# EasyEDA Pro project ProPrj_ProjetElectronique_ESP32Board_2024-12-16.epro, board ESP32Board PCB
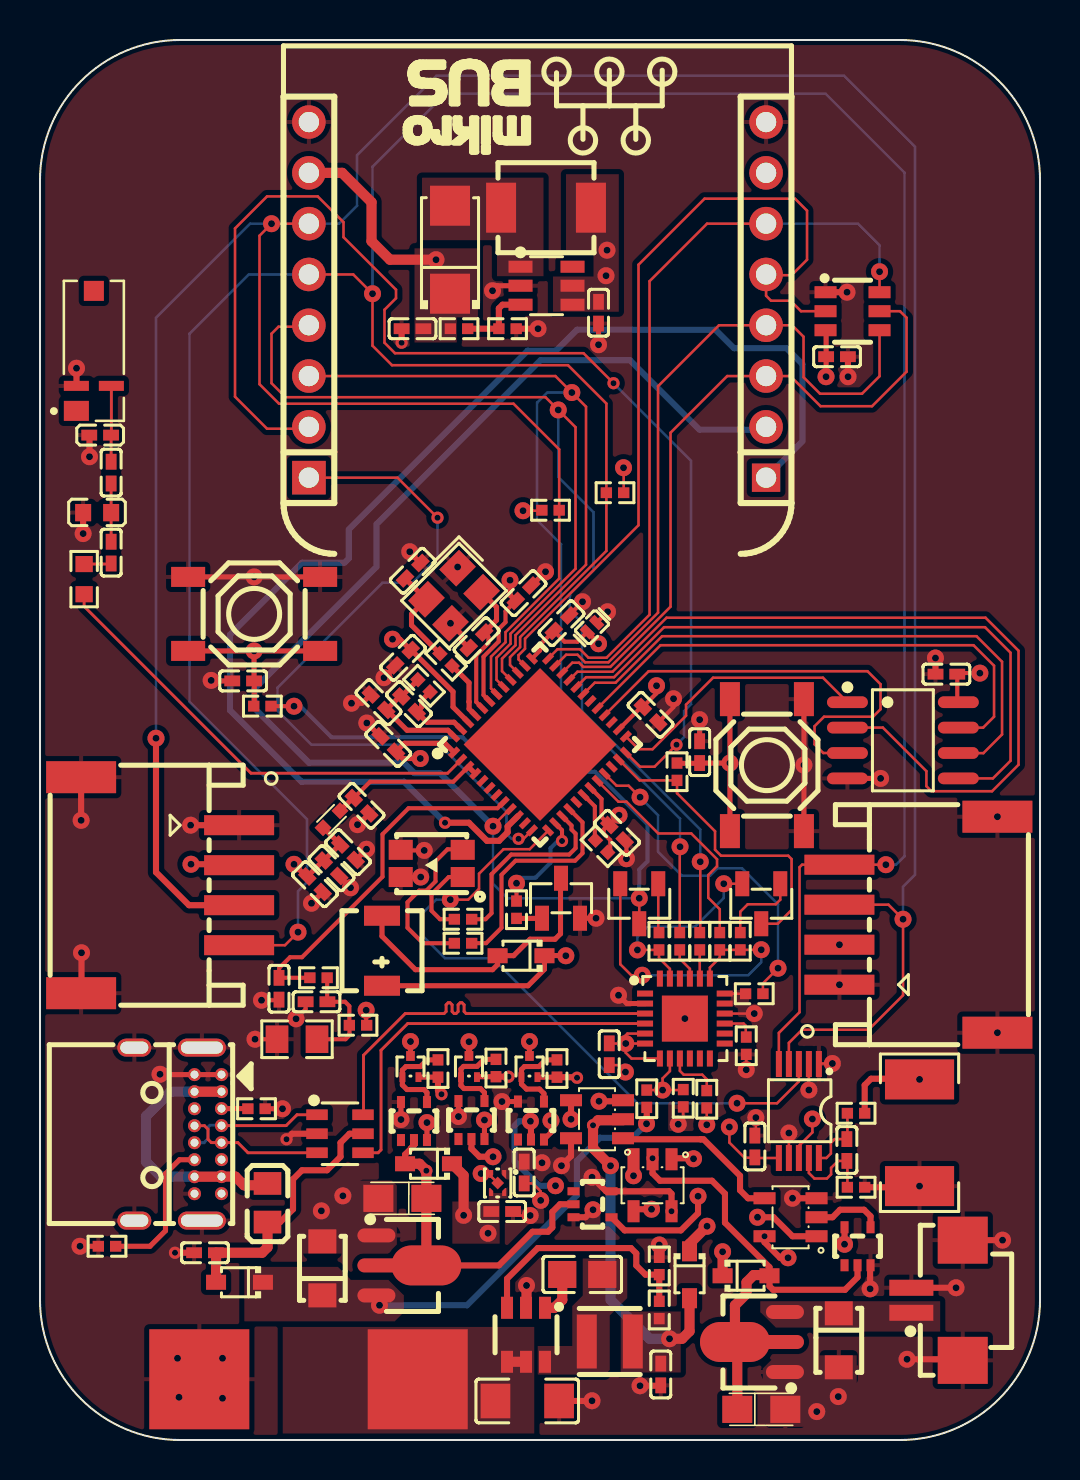
[diagram p7: board, top side]
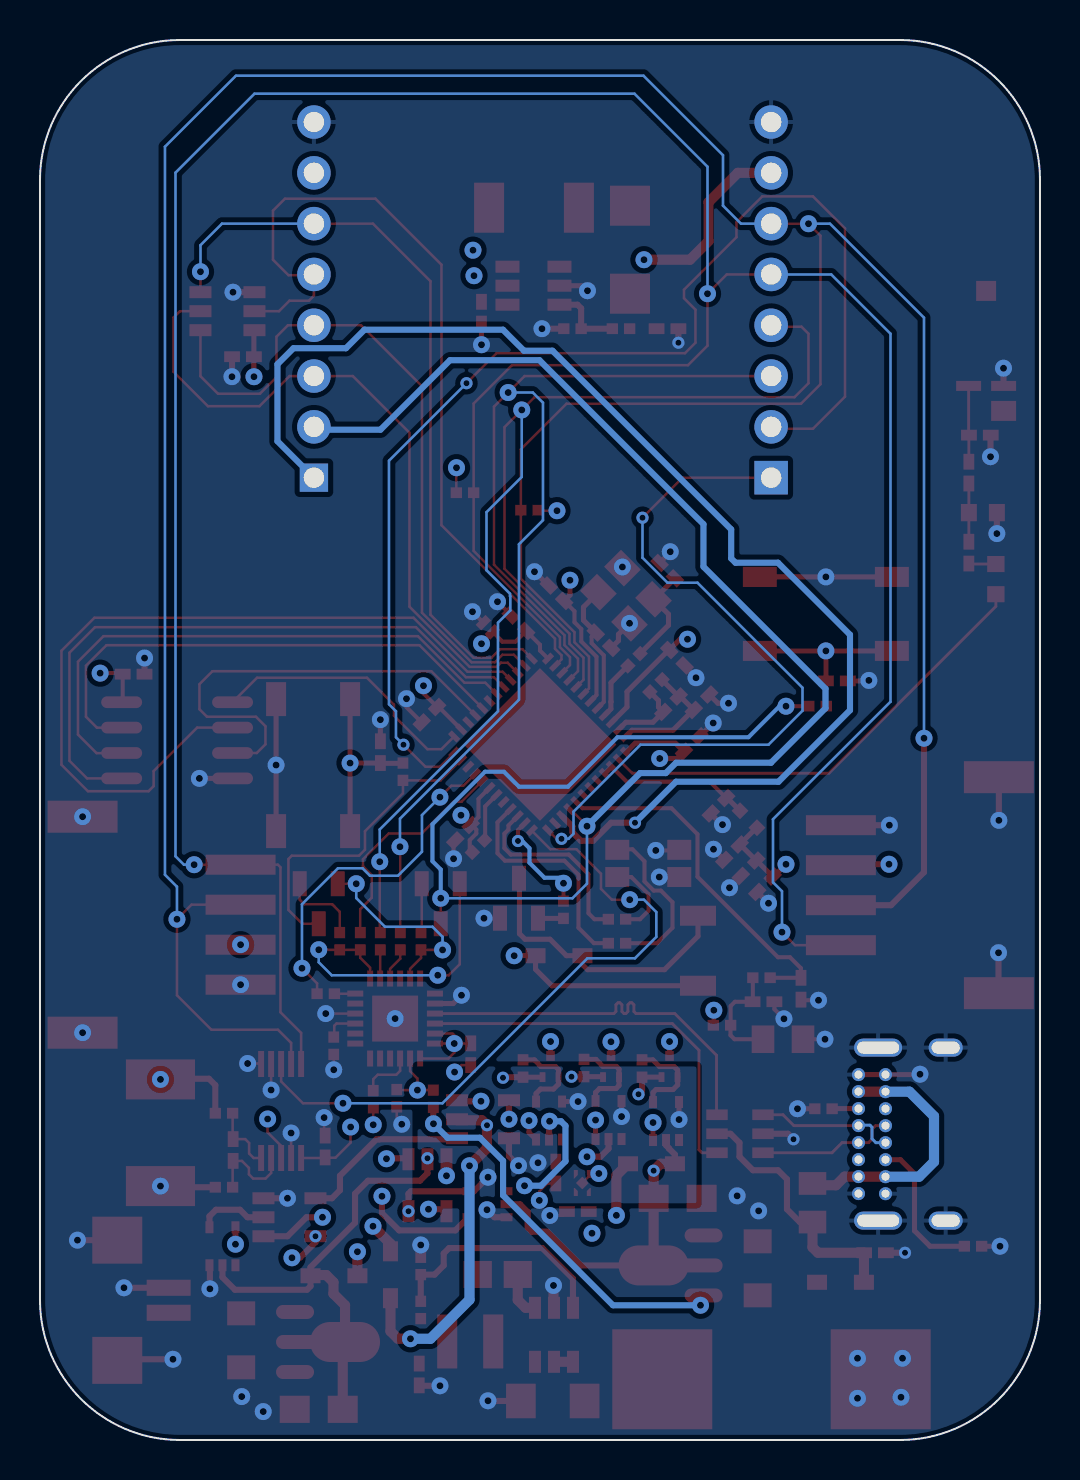
[diagram p8: board, bottom side, seen from below]

Outline 50 x 70 mm; copper layers: Top Layer, GND, PWR, Bottom Layer. Coordinates in mm from the lower left corner of the outline.
Outline path: 0,63 0,7 arc(2.05,2.05) 7,0 43,0 arc(47.95,2.05) 50,7 50,63 arc(47.95,67.95) 43,70 7,70 arc(2.05,67.95) 0,63
Stack: Top Layer 0.035mm Outer layer copper thickness 1oz / Dielectric1 0.2104mm 7628 RC49% 8.6mil / GND 0.0152mm Inner layer copper thickness / Dielectric2 1.065mm 1.1mm H/HOZ Copper / PWR 0.0152mm Inner layer copper thickness / Dielectric3 0.2104mm 7628 RC49% 8.6mil / Bottom Layer 0.035mm Outer layer copper thickness 1oz

## Design rules (mm)
net USB-: DP2
net USB+: DP2
net USB_ESD+: DP1
net USB_ESD-: DP1
template: JLCPCB Capability(Two Layers Board)
spacing copperThickness1oz (default): track to track 0.102, other pairs 0.152 to 0.3
spacing copperThickness2oz: track to track 0.203, other pairs 0.152 to 0.3
track width copperThickness1oz (default): min 0.127, default 0.254, max 2.54
track width copperThickness2oz: min 0.203, default 0.254, max 2.54
differential pair differentialPair (default): width min 0.127, default 0.254, max 2.54; gap min 0.152, default 0.152
via viaSize (default): diameter min 0.5, default 0.61, max 10; hole min 0.3, default 0.305, max 6.3

## Placement (name value [footprint] x y rotation side)
BUZZER1  4kHz  [BUZ-SMD_L4.0-W4.0-P3.50-L]  17.1 24.46 90 top
C1  1uF  [C0402]  15.4 29.39 135 top
C6  100nF  [C0402]  28.85 30.36 135 top
C11  10nF  [C0402]  16.92 36.89 135 top
C12  3.3nF  [C0402]  18.45 36.79 315 top
C13  18pF  [C0402]  18.64 43.46 45 top
C14  100nF  [C0402]  26.08 40.84 45 top
C17  100nF  [C0402]  16.08 31.71 135 top
C18  1uF  [C0402]  14.58 28.59 135 top
C19  100nF  [C0402]  13.75 27.79 135 top
C20  100nF  [C0402]  17.41 34.8 315 top
C21  18pF  [C0402]  21.83 39.99 225 top
C22  1uF  [C0402]  18.15 39.11 45 top
C23  100pF  [C0402]  24.18 42.34 225 top
C24  100nF  [C0402]  30.53 36.26 135 top
C25  0.4pF  [C0402]  3.56 44.37 270 top
C26  0.4pF  [C0402]  3.56 48.37 270 top
C27  100nF  [C0402]  8.25 9.36 0 top
C28  100nF  [C0402]  39.85 54.16 180 top
C29  100nF  [C0402]  28.46 19.29 90 top
C30  100nF  [C0402]  10.16 37.95 180 top
C31  100nF  [C0402]  32.98 34.39 90 top
C32  100nF  [C0402]  35.74 14.68 270 top
C33  1uF  [C0402]  40.34 14.5 90 top
C165  22uF  [C0402]  27.93 56.36 90 top
C166  22uF  [C0402]  18.63 55.56 0 top
C168  22uF  [CASE-A_3216]  36.06 1.53 0 top
C170  22uF  [CASE-A_3216]  18.12 12.08 180 top
C171  10uF  [CAP-SMD_L3.2-W1.6]  14.12 8.58 90 top
C172  10uF  [CAP-SMD_L3.2-W1.6]  39.94 4.98 270 top
C173  2.2uF  [C1206]  24.36 1.95 180 top
C174  100nF  [C0805]  27.11 8.28 180 top
C175  10uF  [C0402]  31.04 3.28 90 top
C176  1uF  [C0402]  23.11 11.43 180 top
C177  1uF  [C0402]  24.21 13.38 90 top
C178  100nF  [C0402]  45.32 38.29 0 top
C181  47nF  [C0402]  11.95 22.56 90 top
C182  47nF  [C0402]  13.83 21.91 0 top
CN1  114020164  [CONN-SMD_4P-P2.00_HX20020-4AWB]  43.92 25.77 90 top
CN2  114020164  [CONN-SMD_4P-P2.00_HX20020-4AWB]  6.01 27.74 270 top
CN3  HC-1.25-2PWT  [CONN-SMD_2P-P1.25-HC-1.25-2PWT]  44.85 6.99 90 top
D2  RCLAMP0521P-N  [X1-DFN1006-2_L1.0-W0.6-P0.65-BI]  27.6 40.64 45 top
D4  SD103AWS-7-F  [SOD-323_L1.8-W1.3-LS2.5-RD]  24.05 24.21 180 top
D5  SD103AWS-7-F  [SOD-323_L1.8-W1.3-LS2.5-RD]  9.98 7.89 180 top
D6  SD103AWS-7-F  [SOD-323_L1.8-W1.3-LS2.5-RD]  19.42 13.81 180 top
D19  SS34  [SMA_L4.3-W2.6-LS5.2-RD]  20.5 59.51 90 top
D20  SD103AWS-7-F  [SOD-323_L1.8-W1.3-LS2.5-RD]  35.3 8.21 0 top
D21  SD103AWS-7-F  [SOD-323_L1.8-W1.3-LS2.5-RD]  32.48 8.26 270 top
L1  GZ2012D101TF  [L0805]  11.38 11.86 90 top
L2  2nH  [IND-SMD_L1.2-W0.6]  14.58 31.04 45 top
L4  4.8nH  [L0402]  3.01 50.24 0 top
L7  4.7uH  [IND-SMD_L4.8-W4.5]  25.3 61.61 180 top
L9  3.3uH  [IND-SMD_L3.0-W3.0-1]  28.49 4.93 0 top
LED1  LTST-C155GEKT  [LED-SMD_4P-L3.2-W2.7-TL_LTST-C155GEKT]  19.59 28.83 180 top
Q14  PCJ3139K  [SOT-723_L1.2-W0.8-P0.40-LS1.2-BR]  18.52 18.67 270 top
Q15  SS8050-G  [SOT-23-3_L2.9-W1.3-P1.90-LS2.4-BR]  26.05 27.09 270 top
Q16  SS8050-G  [SOT-23-3_L2.9-W1.3-P1.90-LS2.4-BR]  29.96 26.81 90 top
Q17  SS8050-G  [SOT-23-3_L2.9-W1.3-P1.90-LS2.4-BR]  36.06 26.81 90 top
Q18  PCJ3139K  [SOT-723_L1.2-W0.8-P0.40-LS1.2-BR]  24.47 18.67 270 top
Q19  PCJ3139K  [SOT-723_L1.2-W0.8-P0.40-LS1.2-BR]  21.45 18.67 270 top
R2  0Ω  [R0402]  28.08 29.69 315 top
R101  0Ω  [R0603]  2.21 43.04 270 top
R102  5.1kΩ  [R0402]  3.35 9.69 180 top
R103  5.1kΩ  [R0402]  10.83 16.56 0 top
R104  180Ω  [R0402]  23.83 26.51 270 top
R105  10kΩ  [R0402]  30.95 24.94 90 top
R106  10kΩ  [R0402]  35.01 24.94 90 top
R107  22.1kΩ  [R0402]  30.34 17.06 270 top
R108  47.5kΩ  [R0402]  32.16 17.09 90 top
R109  2kΩ  [R0402]  33.34 17.04 270 top
R110  10kΩ  [R0402]  35.31 19.71 270 top
R111  1kΩ  [R0402]  31.99 24.94 270 top
R112  1kΩ  [R0402]  32.99 24.94 270 top
R113  0Ω  [R0402]  33.99 24.94 90 top
R114  0Ω  [R0402]  35.71 22.31 0 top
R115  0Ω  [R0402]  11.12 36.69 180 top
R116  0Ω  [R0402]  31.85 33.41 90 top
R119  100Ω  [R0402]  21.15 26.04 0 top
R120  100Ω  [R0402]  21.15 24.84 0 top
R121  10kΩ  [R0402]  25.53 46.49 180 top
R122  10kΩ  [R0402]  28.75 47.36 0 top
R123  SDNT2012X103F3950FTF  [R0805]  12.85 20.04 0 top
R124  10kΩ  [R0402]  15.9 20.74 0 top
R125  90.9Ω  [R0402]  40.8 16.34 0 top
R126  90.9Ω  [R0402]  40.8 12.64 0 top
R127  100kΩ  [R0402]  19.9 18.57 270 top
R128  100kΩ  [R0402]  25.85 18.57 270 top
R129  100kΩ  [R0402]  22.8 18.6 270 top
R134  110kΩ  [R0402]  20.95 55.56 180 top
R135  15kΩ  [R0402]  23.38 55.56 180 top
R136  51kΩ  [R0402]  30.96 6.5 270 top
R137  22.1kΩ  [R0402]  30.96 8.7 270 top
R138  5.1kΩ  [R0402]  13.92 23.11 0 top
SW1  TS-1187A-B-A-B  [SW-SMD_4P-L5.1-W5.1-P3.70-LS6.5-TL-2]  10.71 41.3 180 top
SW4  TS-1187A-B-A-B  [SW-SMD_4P-L5.1-W5.1-P3.70-LS6.5-TL-2]  36.35 33.74 90 top
U1  -  [LGA-48_L7.0-W7.0-P0.50-BL-EP5.4]  25 34.78 315 top
U2  CP2104-F03-GM  [VQFN-24_L4.0-W4.0-P0.50-BL-EP2.3]  32.24 21.07 270 top
U4  51Ω  [R0402]  20.3 39.01 135 top
U6  20kΩ  [R0402]  19.2 37.71 315 top
U9  USBLC6-4SC6  [SOT-23-6_L2.9-W1.6-P0.95-LS2.8-BL]  15 15.31 270 top
U71  INA237AIDGSR  [VSSOP-10_L3.0-W3.0-P0.50-LS4.9-BL]  37.94 16.45 180 top
U72  LMR50410Y3FQDBVRQ1  [SOT-23-6_L2.9-W1.6-P0.95-LS2.8-BR]  24.3 5.26 90 top
U76  AMS1117-3.3  [SOT-89-3_L4.5-W2.5-P1.50-LS4.1-BL]  36 4.9 90 top
U77  -  [XCVR_NN03-320]  2.69 54.46 270 top
U78  VTI7064MSME  [SOIC-8_L4.9-W3.9-P1.27-LS6.0-BL]  43.14 34.98 270 top
U80  TMP125AIDBVR  [SOT-23-6_L2.9-W1.6-P0.95-LS2.8-BR]  40.63 56.44 180 top
U81  7.5nH  [L0603]  2.86 46.37 0 top
U82  MIKROBUS_HOST_CONN  [MIKROBUSTOP]  24.87 57.01 180 top
U84  -  [High Voltage Pads]  13.42 3.04 180 top
U86  74LVC1G14GW,125  [SOT-353-5_L2.0-W2.1-P0.65-BR]  27.63 11.79 180 top
U90  74LVC1G14GW,125  [SOT-353-5_L2.0-W2.1-P0.65-BR]  40.88 9.69 270 top
U91  SN74AHC1G08DBVR  [SOT-23-5_L3.0-W1.7-P0.95-LS2.8-BR]  30.63 12.74 90 top
U92  SN74AHC1G08DBVR  [SOT-23-5_L3.0-W1.7-P0.95-LS2.8-BR]  37.53 11.14 0 top
U93  SN74AHC1G08DBVR  [SOT-23-5_L3.0-W1.7-P0.95-LS2.8-BR]  27.85 16.04 0 top
U94  74LVC1G14GW,125  [SOT-353-5_L2.0-W2.1-P0.65-BR]  18.7 15.95 270 top
U95  74LVC1G14GW,125  [SOT-353-5_L2.0-W2.1-P0.65-BR]  21.57 16 270 top
U96  74LVC1G14GW,125  [SOT-353-5_L2.0-W2.1-P0.65-BR]  24.55 15.97 270 top
U128  MT3608L  [SOT-23-6_L2.9-W1.6-P0.95-LS2.8-BL_3]  25.33 57.71 270 top
U129  AMS1117-3.3  [SOT-89-3_L4.5-W2.5-P1.50-LS4.1-BL]  18.07 8.73 270 top
U130  NCP167BMX330TBG  [XDFN-4_L1.0-W1.0-P0.65-BL-EP]  22.88 12.85 180 top
U131  0.5mΩ  [RES-SMD_L6.3-W3.2_R2512]  43.98 15.36 90 top
USB2  USB4085-GF-A  [USC-C-SMD_USB4085-GF-A]  6.89 15.29 270 top
X2  40MHz  [CRYSTAL-SMD_4P-L3.2-W2.5-BL]  20.7 42.21 225 top

## Footprints (pads in the part's own frame, mm; a bottom-side part is the same pattern mirrored in y, then rotated)
BUZ-SMD_L4.0-W4.0-P3.50-L
  rect 1x1.8 smd: 1(-1.75,0) 2(1.75,0)
C0402
  rect 0.79x0.54 smd: 1(-0.545,0) 2(0.545,0)
C0805
  rect 1.41x1.35 smd: 1(-1,0) 2(1,0)
C1206
  rect 1.485x1.728 smd: 1(-1.593,0) 2(1.593,0)
CAP-SMD_L3.2-W1.6
  rect 1.2x1.4 smd: 1(-1.35,0) 2(1.35,0)
CASE-A_3216
  rect 1.5x1.359 smd: 1(-1.2,0) 2(1.2,0)
CONN-SMD_2P-P1.25-HC-1.25-2PWT
  rect 0.8x2.2 smd: 1(-0.625,1.285) 2(0.625,1.285)
  rect 2.35x2.5 smd: 3(-3.005,-1.285) 4(3.005,-1.285)
CONN-SMD_4P-P2.00_HX20020-4AWB
  rect 1x3.5 smd: 1(-3,3.95) 2(-1,3.95) 3(1,3.95) 4(3,3.95)
  rect 1.6x3.5 smd: 5(5.4,-3.95) 6(-5.4,-3.95)
CRYSTAL-SMD_4P-L3.2-W2.5-BL
  rect 1.4x1.2 smd: 1(-1.1,-0.85) 2(1.1,-0.85) 3(1.1,0.85) 4(-1.1,0.85)
High Voltage Pads
  rect 5x5 smd: 1(-5.461,0) 2(5.461,0)
IND-SMD_L1.2-W0.6
  rect 0.6x0.6 smd: 1(-0.6,0) 2(0.6,0)
IND-SMD_L3.0-W3.0-1
  rect 1x2.7 smd: 1(-1.15,0) 2(1.15,0)
IND-SMD_L4.8-W4.5
  rect 1.5x2.5 smd: 1(-2.245,0) 2(2.245,0)
L0402
  rect 0.79x0.54 smd: 1(-0.545,0) 2(0.545,0)
L0603
  rect 0.8x0.864 smd: 1(-0.7,0) 2(0.7,0)
L0805
  rect 1.133x1.377 smd: 1(-0.966,0) 2(0.966,0)
LED-SMD_4P-L3.2-W2.7-TL_LTST-C155GEKT
  rect 1.2x1 smd: 1(-1.55,0.68) 2(-1.55,-0.68) 3(1.55,0.68) 4(1.55,-0.68)
LGA-48_L7.0-W7.0-P0.50-BL-EP5.4
  rect 0.27x0.6 smd: 1(-2.75,-3.32) 2(-2.25,-3.32) 3(-1.75,-3.32) 4(-1.25,-3.32) 5(-0.75,-3.32) 6(-0.25,-3.32) 7(0.25,-3.32) 8(0.75,-3.32) 9(1.25,-3.32) 10(1.75,-3.32) 11(2.25,-3.32) 12(2.75,-3.32) 25(2.75,3.32) 26(2.25,3.32) 27(1.75,3.32) 28(1.25,3.32) 29(0.75,3.32) 30(0.25,3.32) 31(-0.25,3.32) 32(-0.75,3.32) 33(-1.25,3.32) 34(-1.75,3.32) 35(-2.25,3.32) 36(-2.75,3.32)
  rect 0.6x0.27 smd: 13(3.32,-2.75) 14(3.32,-2.25) 15(3.32,-1.75) 16(3.32,-1.25) 17(3.32,-0.75) 18(3.32,-0.25) 19(3.32,0.25) 20(3.32,0.75) 21(3.32,1.25) 22(3.32,1.75) 23(3.32,2.25) 24(3.32,2.75) 37(-3.32,2.75) 38(-3.32,2.25) 39(-3.32,1.75) 40(-3.32,1.25) 41(-3.32,0.75) 42(-3.32,0.25) 43(-3.32,-0.25) 44(-3.32,-0.75) 45(-3.32,-1.25) 46(-3.32,-1.75) 47(-3.32,-2.25) 48(-3.32,-2.75)
  rect 5.4x5.4 smd: 49(0,0)
MIKROBUSTOP
  rect 1.415x1.415 hole 1.016: 1(-11.429,8.89)
  round 1.677 hole 1.016: 2(-11.43,6.349) 3(-11.43,3.809) 4(-11.43,1.27) 5(-11.43,-1.27) 6(-11.43,-3.811) 7(-11.43,-6.351) 8(-11.43,-8.89) 9(11.43,-8.89) 10(11.43,-6.351) 11(11.43,-3.811) 12(11.43,-1.27) 13(11.43,1.27) 14(11.43,3.809) 15(11.43,6.349)
  rect 1.677x1.677 hole 1.016: 16(11.43,8.889)
R0402
  rect 0.566x0.54 smd: 1(-0.433,0) 2(0.433,0)
R0603
  rect 0.806x0.864 smd: 1(-0.753,0) 2(0.753,0)
R0805
  rect 1.133x1.377 smd: 1(-1,0) 2(1,0)
RES-SMD_L6.3-W3.2_R2512
  rect 2x3.456 smd: 1(-2.667,0) 2(2.667,0)
SMA_L4.3-W2.6-LS5.2-RD
  rect 2x2 smd: 1(-2.2,0) 2(2.2,0)
SOD-323_L1.8-W1.3-LS2.5-RD
  rect 1x0.75 smd: 1(-1.173,0) 2(1.173,0)
SOIC-8_L4.9-W3.9-P1.27-LS6.0-BL
  oval 0.588x2.045 smd: 1(-1.905,-2.772) 2(-0.635,-2.772) 3(0.635,-2.772) 4(1.905,-2.772) 5(1.905,2.772) 6(0.635,2.772) 7(-0.635,2.772) 8(-1.905,2.772)
SOT-23-3_L2.9-W1.3-P1.90-LS2.4-BR
  rect 1.25x0.7 smd: 1(1,-0.95) 2(1,0.95) 3(-1,0)
SOT-23-5_L3.0-W1.7-P0.95-LS2.8-BR
  rect 1.1x0.6 smd: 1(1.3,-0.95) 2(1.3,0) 3(1.3,0.95) 4(-1.3,0.95) 5(-1.3,-0.95)
SOT-23-6_L2.9-W1.6-P0.95-LS2.8-BL
  rect 0.532x1.072 smd: 1(-0.95,-1.149) 2(0,-1.149) 3(0.95,-1.149) 4(0.95,1.149) 5(0,1.149) 6(-0.95,1.149)
SOT-23-6_L2.9-W1.6-P0.95-LS2.8-BL_3
  rect 0.6x1.2 smd: 1(-0.95,-1.3) 2(0,-1.3) 3(0.95,-1.3) 4(0.95,1.3) 5(0,1.3) 6(-0.95,1.3)
SOT-23-6_L2.9-W1.6-P0.95-LS2.8-BR
  rect 1.1x0.6 smd: 1(1.35,-0.95) 2(1.35,0) 3(1.35,0.95) 4(-1.35,0.95) 5(-1.35,0) 6(-1.35,-0.95)
SOT-89-3_L4.5-W2.5-P1.50-LS4.1-BL
  oval 0.7x1.9 smd: 1(-1.501,-1.25) 3(1.501,-1.25)
  oval 2x3.5 smd: 2(0,1.25)
  oval 0.7x2.1 smd: 2(0,-1.151)
SOT-353-5_L2.0-W2.1-P0.65-BR
  rect 0.6x0.4 smd: 1(0.95,-0.65) 2(0.95,0) 3(0.95,0.65) 4(-0.95,0.65) 5(-0.95,-0.65)
SOT-723_L1.2-W0.8-P0.40-LS1.2-BR
  rect 0.489x0.294 smd: 1(0.529,-0.4) 2(0.529,0.4)
  rect 0.489x0.434 smd: 3(-0.529,0)
SW-SMD_4P-L5.1-W5.1-P3.70-LS6.5-TL-2
  rect 1.7x1 smd: 1(-3.3,1.85) 2(3.3,1.85) 3(-3.3,-1.85) 4(3.3,-1.85)
USC-C-SMD_USB4085-GF-A
  round 0.65 hole 0.4: A1(-2.975,2.18) A4(-2.125,2.18) A5(-1.275,2.18) A6(-0.425,2.18) A7(0.425,2.18) A8(1.275,2.18) A9(2.125,2.18) A12(2.975,2.18) B1(2.98,0.83) B4(2.13,0.83) B5(1.28,0.83) B6(0.43,0.83) B7(-0.42,0.83) B8(-1.27,0.83) B9(-2.12,0.83) B12(-2.975,0.83)
  oval 0.9x2.4 hole 0.6x2.1: S1(-4.325,1.2) S1(4.325,1.2)
  oval 0.9x1.7 hole 0.6x1.4: S1(-4.325,-2.18) S1(4.325,-2.18)
VQFN-24_L4.0-W4.0-P0.50-BL-EP2.3
  rect 0.3x0.8 smd: 1(-1.25,-1.992) 2(-0.75,-1.992) 3(-0.25,-1.992) 4(0.25,-1.992) 5(0.75,-1.992) 6(1.25,-1.992) 13(1.25,1.992) 14(0.75,1.992) 15(0.25,1.992) 16(-0.25,1.992) 17(-0.75,1.992) 18(-1.25,1.992)
  rect 0.8x0.3 smd: 7(1.998,-1.25) 8(1.998,-0.75) 9(1.998,-0.25) 10(1.998,0.25) 11(1.998,0.75) 12(1.998,1.25) 19(-1.998,1.25) 20(-1.998,0.75) 21(-1.998,0.25) 22(-1.998,-0.25) 23(-1.998,-0.75) 24(-1.998,-1.25)
  rect 2.3x2.3 smd: 25(0.001,-0.001)
VSSOP-10_L3.0-W3.0-P0.50-LS4.9-BL
  rect 0.3x1.3 smd: 1(-1,-2.35) 2(-0.5,-2.35) 3(0,-2.35) 4(0.5,-2.35) 5(1,-2.35) 6(1,2.35) 7(0.5,2.35) 8(0,2.35) 9(-0.5,2.35) 10(-1,2.35)
X1-DFN1006-2_L1.0-W0.6-P0.65-BI
  rect 0.4x0.7 smd: 1(-0.325,0) 2(0.325,0)
XCVR_NN03-320
  rect 1x1 smd: 1(-3,0)
  rect 0.5x1.25 smd: 2(1.75,-0.875) 3(1.75,0.875)
  rect 1x1.25 smd: 4(3,-0.875)
XDFN-4_L1.0-W1.0-P0.65-BL-EP
  custom 0.2x0.45 smd: 1(-0.325,-0.475)
  custom 0.2x0.4 smd: 2(0.325,-0.475) 3(0.325,0.475) 4(-0.325,0.475)
  rect 0.45x0.45 smd rot 45: 5(0,0)

## Nets
As in the schematic, except:
GND: C1.1 C6.1 C11.2 C13.2 C14.2 C17.1 C18.1 C19.1 C20.1 C21.2 C22.1 C23.1 C24.1 C27.1 C28.1 C29.1 C30.2 C31.2 C32.1 C165.1 C166.1 C168.2 C170.2 C171.2 C172.2 C173.1 C175.1 C176.1 C177.1 C178.1 C181.1 C182.1 CN1.1 CN1.5 CN1.6 CN2.1 CN2.5 CN2.6 CN3.2 CN3.3 CN3.4 D2.2 L4.1 LED1.3 LED1.4 Q15.2 R102.2 R103.2 R108.1 R110.2 R123.1 R126.2 R135.1 R137.1 SW1.3 SW1.4 SW4.3 SW4.4 U1.49 U2.2 U2.16 U2.25 U9.2 U71.1 U71.2 U71.7 U72.2 U76.1 U77.2 U78.4 U80.1 U81.1 U82.8 U82.9 U84.2 U86.3 U90.3 U91.3 U92.3 U93.3 U94.3 U95.3 U96.3 U128.2 U129.1 U130.2 U130.5 U131.1 USB2.A1 USB2.A12 USB2.B1 USB2.B12 USB2.S1 X2.1 X2.3

Pads without a net: U1 5 6 7 11 17 22 27 30; U2 1 10 11 12 13 14 17 22 24; U77 1 4; U86 1; U90 1; U94 1; U95 1; U96 1; U128 6; USB2 A8 B8

## Via types
v1: diameter 0.85, hole 0.35, Top Layer to Bottom Layer, 157 vias
v2: diameter 0.61, hole 0.305, Top Layer to Bottom Layer, 17 vias

## Routing (per net, layer and track width the routed paths; a pad name or vN(x,y) marks a point on that pad's centre or on a via; arc(x,y) is an arc through that point)
+3V3: length 73.6
  Top Layer w0.127: R109.2 v1(33.34,15.76) ; 30.99,19.07 29.58,19.07 29.29,19.36 v1(29.29,19.82) ; v1(34.47,15.65) 34.47,14.87 35.23,14.11 35.73,14.11 C32.2 35.77,14.1 U71.6 ; U2.6 29.29,19.82 v1(29.29,19.82) ; R122.2 29.18,48.61 v1(29.18,48.61) ; v1(29.29,19.82) 29.29,20.24 29.37,20.32 30.25,20.32 ; v1(29.29,19.82) 28.47,19.82 C29.2 ; v1(24.15,46.46) 25.07,46.46 R121.2 ; U71.8 37.94,14.7 38.62,15.38 v1(38.62,16.05)
  Top Layer w0.203: U1.37 25,39.47 25,39.76 25.69,40.45 26.23,39.91 26.88,39.91 D2.1 27.93,39.85 v1(27.93,39.81) ; v1(28.95,31.24) 28.47,30.75 C6.2 ; U1.19 28.08,32.05 28.08,31.14 C6.2 ; R124.2 16.31,20.76 v1(16.31,21.49) ; C6.2 28.41,30.75 28.18,30.52 28.18,30.32 28.51,29.99 28.51,29.51 28.38,29.38 ; U1.43 22.18,37.25 22.18,39.17 22.93,39.93 22.93,40.55 23.28,40.89 23.28,41.44 23.79,41.95 ; v1(46.99,38.34) 46.99,38.35 45.92,38.35 C178.2 45.86,36.94 U78.8 ; v1(30.83,37.71) 30.83,37.33 C24.2 30.06,36.65 U1.26
  Top Layer w0.254: U1.1 20.24,34.84 18.22,34.84 C20.2 18.14,34.08 v1(19.01,34.08) ; U80.3 39.31,55.46 C28.2 39.31,53.17 v1(39.3,53.16) ; v1(17.63,40.04) 18,40.04 18.54,39.5 18.57,39.5 20.65,37.41 20.65,36.65 U1.46 ; BUZZER1.1 24.4,22.71 25.22,23.54 D4.1 25.23,24.22 26.28,24.22 v1(26.29,24.21) ; v1(12.7,28.78) 13.31,28.17 C19.2 14.16,28.97 14.19,28.97 14.99,29.77 C1.2 14.17,30.61 L2.1 ; Q18.3 v1(24.47,19.92) ; v1(23.5,42.99) 23.5,42.24 23.79,41.95 ; Q14.3 v1(18.52,19.92)
  Top Layer w0.305: CN2.2 9.83,28.74 9.78,28.79 v1(7.55,28.79) ; R125.2 41.23,17.75 41.55,18.06 43.94,18.06 v1(43.98,18.03) ; Q19.3 21.45,19.2 v1(21.45,19.91)
  vias: v1(28.35,59.49) v1(28.3,58.21) v1(39.97,24.77)
+5V: length 9.3
  Top Layer w0.508: 13.44,63.36 15.11,63.36 16.58,61.89 16.58,59.94 17.5,59.01 v1(19.8,59.01)
GND: length 97.2
  Top Layer w0.127: v1(39.62,18.83) 38.97,18.83 U71.1 ; v1(31.91,15.79) 32.16,16.04 R108.1 ; C32.1 35.79,15.27 v1(35.79,16.12) ; U71.7 v1(37.44,15.35) ; R110.2 v1(35.31,18.51) ; 34.24,21.32 v1(35.71,21.32) ; v1(29.27,18.4) 28.93,18.74 C29.1 ; v1(22.06,13.32) 22.56,13.32 22.56,13.18 U130.5 ; v1(25.03,11.98) 25.03,12.43 24.63,12.83 C177.1 ; C176.1 23.85,11.22 v1(24.51,11.22) ; U71.2 v1(38.44,17.5)
  Top Layer w0.203: v1(29.32,29.06) 29.32,29.89 C6.1 ; D2.2 v1(28.38,41.41) ; C14.2 26.46,41.25 v1(27.13,41.91) ; v1(19.21,29.48) 18.07,29.48 LED1.4 ; v1(11.08,21.99) 11.92,21.99 C181.1 ; v1(31.68,37.06) 31.68,36.64 C24.1 ; v1(12.8,21.06) 13.28,21.54 C182.1 ; LED1.3 v1(19.04,28.15) ; R123.1 v1(10.75,20.04)
  Top Layer w0.254: C1.1 15.79,29 v1(16.33,29.54) ; v1(15.58,36.84) 16.1,36.84 C11.2 ; U128.2 22.88,57.71 v1(22.63,57.46) ; v1(8.56,37.98) 8.58,37.95 C30.2 ; 27.93,55.82 v1(27.93,54.76) ; U94.3 v1(19.35,15.87) ; U96.3 25.55,15.37 v1(25.55,15.97) ; SW1.3 v1(10.71,43.16) SW1.4 ; v1(25.28,43.41) 24.59,42.72 C23.1 ; 14.14,27.4 14.14,27.4 v1(13.58,26.84) ; v1(6,18.29) 6.02,18.27 USB2.B12 USB2.A1 ; SW4.3 v1(38.2,33.75) SW4.4 ; v1(28.93,22.24) 29.34,21.82 U2.2 ; v1(15.88,30.77) 15.9,30.77 16.46,31.32 C17.1 ; R102.2 v1(2,9.69) ; C18.1 14.96,28.18 v1(15.52,27.61) ; v1(17.2,38.11) 17.76,38.68 C22.1 ; C31.2 v1(32.98,36.02) ; C21.2 21.08,39.97 21.08,40.28 v1(20.52,40.83) ; v1(16.34,35.85) 17,35.19 C20.1 ; 22.22,15.05 v1(22.22,16) ; 40.37,33.08 v1(42.03,33.08) ; C13.2 18.49,44.39 v1(18.49,44.41) ; Q15.2 v1(27.8,26.09) ; 11.26,16.56 v1(12.13,16.56)
  Top Layer w0.305: v1(40.4,53.16) 40.4,53.17 C28.1 ; v1(43.98,12.7) 43.92,12.64 R126.2 ; U86.3 27.28,11.14 v1(27.65,11.51) ; C27.1 v2(6.75,9.36) ; C166.1 v2(18.08,54.86) ; 29.68,14.09 v1(29.68,13.21) ; v1(2.07,24.36) 2.07,22.36 2.06,22.34 ; v1(27.6,1.96) 27.59,1.95 C173.1 ; U80.1 v1(40.35,57.39) ; v2(12.33,15.04) 12.6,15.31 U9.2 ; U81.1 v1(2.16,45.32) ; v1(43.35,4.04) 46.08,4.04 CN3.3 ; CN2.1 v1(7.53,30.74) ; v1(30,2.71) 31.02,2.71 C175.1 ; 38.83,12.09 v1(37.63,12.09) ; v1(41.5,7.56) 41.5,8.72 U90.3 ; U77.2 1.82,52.71 v1(1.82,53.59) ; L4.1 2.47,50.23 v1(2.47,49.16) ; 44.77,38.29 v1(44.77,39.1) ; 29.15,16.94 v1(27.95,16.94) ; CN3.4 v1(48.13,9.99) ; R137.1 v1(30.96,9.75) ; CN3.2 v1(45.8,7.61) ; 2.06,33.14 v1(2.06,30.98) ; R135.1 v1(24.9,55.56)
  Top Layer w0.508: v1(24.33,7.73) 24.33,6.64 U72.2
  vias: v1(6.87,4.09) v1(6.95,2.14) v1(9.12,4.09) v1(9.12,2.09) v1(14.07,11.46) v1(15.14,12.21) v1(20.88,43.65) v1(32.24,21.07) v1(38.84,1.42) v1(39.91,2.17) v1(39.97,22.77) v1(47.87,31.17) v1(47.87,20.37)
VBUS: length 18.9
  Top Layer w0.305: R107.2 30.34,15.82 v1(30.33,15.81)
  Bottom Layer w0.305: v1(30.33,15.81) 29.63,15.11 28,15.11 26.85,13.96 26.85,12.23 21.35,6.74 v1(16.98,6.74)
VBUS_3V3: length 22.4
  Top Layer w0.254: R127.2 19.89,18.14 18.92,18.14
  Top Layer w0.305: U94.2 18.7,14.73 18.55,14.59 18.55,14.57 18.25,14.27 D6.2 ; v2(20.08,17.29) 19.9,17.47 R127.2 ; U86.2 26,11.79 25.62,11.4 25.62,10.63 25.4,10.41 24.63,10.41 22.94,8.73 U129.2
  Top Layer w0.508: U129.2 19.32,8.73 C170.1 v2(19.32,13.47) 18.97,13.81 D6.2
  PWR w0.305: v2(20.08,17.29) 20.08,16.18 20.08,16.18 20.08,15.57 20.08,15.57 20.08,14.51 19.32,13.75 v2(19.32,13.47)
VCC_HT: length 1
  Top Layer w0.508: U72.5 U72.4
ALWAYS_ON_IN: length 18.7
  Top Layer w0.508: v1(21.18,11.23) 21.18,13.23 20.6,13.81 ; D20.1 v1(34.13,9.41) ; v1(33.35,10.69) 32.48,9.81 D21.1
  PWR w0.508: v1(34.13,9.41) 34.13,10.46 33.9,10.69 v1(33.35,10.69) 29.13,10.69 28.78,10.34 v1(22.4,10.34)
ALWAYS_ON_OUT: length 16.9
  Top Layer w0.254: U95.5 v1(20.92,16.17) ; U94.5 v1(18.05,16.02) ; U96.5 v1(23.1,16.92)
  Top Layer w0.305: v2(36.23,10.19) 36.23,9.89 37,9.11 v1(37.4,9.11) ; 26.55,15.04 26.55,14.19 v1(26.07,13.72) ; v1(27.6,13.14) 28.3,12.44 U86.5 31.45,12.44 31.58,12.31 31.58,11.49 ; U90.5 v1(40.23,9.79)
  PWR w0.305: v2(36.23,10.19) 35.23,10.19 33.98,11.44 v2(31.58,11.44)
  vias: v1(25.1,13.86)
ANALOG: length 64.5
  Top Layer w0.305: v2(20.25,30.86) 21.44,30.86 22.35,29.96 22.95,29.96 23.38,30.39 23.38,30.68 U1.10
  Bottom Layer w0.305: U82.1 38.13,49.94 38.13,53.79 37.33,54.59 34.7,54.59 33.78,55.51 26.85,55.51 25.8,54.46 24.38,54.46 15.44,45.53 15.44,44.08 15.23,43.86 13.1,43.86 9.5,40.26 9.5,36.49 13.08,32.91 18.2,32.91 v2(20.25,30.86)
BT_3V3: length 32
  Top Layer w0.254: R128.2 24.88,18.14 24.87,18.14
  Top Layer w0.305: v2(26.85,18.11) 26.82,18.14 R128.2 ; v2(30.63,14.09) 30.63,13.34 31,12.96 33.6,12.96 34.25,12.32 34.25,10.87 36.47,8.64 D20.2 36.47,7.69 36.65,7.51 40.25,7.51 40.88,8.14 U90.2
  Top Layer w0.508: C168.1 34.86,4.78 U76.2 34.75,6.73 35.33,7.31 35.33,7.89 35.69,8.25 36.44,8.25 D20.2
  PWR w0.305: v2(30.63,14.09) 29.18,15.54 29.18,17.21 28.28,18.11 v2(26.85,18.11)
BUZZER: length 5.5
  Top Layer w0.203: R104.1 v1(23.83,27.84) ; U1.14 26.1,30.49 v2(26.1,29.95)
  Bottom Layer w0.203: v2(26.1,29.95) 25.89,29.95 25.53,29.59 25.53,28.86 24.78,28.11 24.03,28.11 23.83,27.91 v1(23.83,27.84)
CTN: length 17.9
  Top Layer w0.203: U1.8 22.87,31.59 18.42,31.59 17.13,30.29 17.13,28.16 13.1,24.14 12.5,24.14 11.95,23.59 11.95,23.11 ; 11.95,23.11 C181.2 ; 11.95,23.11 R138.1
CTS: length 1
  Top Layer w0.127: 34.24,22.32 34.24,22.31 R114.1
DTR: length 10.2
  Top Layer w0.127: U2.23 31.49,23.56 30.95,24.1 30.95,24.5 v1(29.87,24.5) ; v1(34.19,27.81) Q17.2
  Bottom Layer w0.127: v1(29.87,24.5) 29.87,25.16 30.37,25.66 32.75,25.66 34.19,27.1 v1(34.19,27.81)
EN: length 89.3
  Top Layer w0.127: v1(22.65,30.69) 22.65,30.71 23.48,31.54 U1.9 ; Q16.3 v1(29.96,27.09)
  Top Layer w0.203: v1(12.7,36.69) 12.7,36.69 R115.1
  Bottom Layer w0.127: v1(29.96,27.09) 23.38,27.09 22.65,27.81 v1(22.65,30.69)
  Bottom Layer w0.203: v1(12.7,36.69) 13.02,36.69 14.58,35.14 21.13,35.14 23.6,32.66 26.05,32.66 26.8,33.41 27.75,33.41 30.38,30.79 30.38,28.94 29.96,28.52 v1(29.96,27.09)
  Bottom Layer w0.305: U82.2 36.16,50.51 32.98,50.51 29.5,53.99 25.03,53.99 16.83,45.79 16.83,43.66 10.73,37.56 10.73,36.59 13.45,33.86 18.19,33.86 18.71,33.35 19.99,33.35 v1(22.65,30.69)
GATE_BT: length 12.4
  Top Layer w0.305: U96.2 24.55,15.91 v1(24.52,15.94) ; 29.68,11.49 29.73,11.54 v1(30.58,11.54)
  PWR w0.305: v1(30.58,11.54) 29.05,11.54 28.25,12.34 26.83,12.34 26.45,12.71 v1(25.77,12.71)
  Bottom Layer w0.305: v1(24.52,15.94) 23.95,15.94 23.73,15.71 23.73,13.94 24.95,12.71 v1(25.77,12.71)
GATE_BT_INV: length 4.4
  Top Layer w0.254: 25.85,19.01 25.28,19.01 24.95,18.67 24.22,18.67 24.07,18.52 24.07,17.8 24.32,17.55 24.97,17.55 25.2,17.32 U96.4
GATE_HT: length 7.7
  Top Layer w0.305: 21.57,15.05 21.57,14.56 21.98,14.16 v1(22.65,14.16) ; 26.55,16.94 v1(26.55,16.04)
  PWR w0.305: v1(26.55,16.04) 26.55,15.39 25.8,14.64 23.13,14.64 v1(22.65,14.16)
GATE_HT_INV: length 4.5
  Top Layer w0.254: U95.4 22.22,17.37 22.02,17.57 21.2,17.57 21.05,17.72 21.05,18.55 21.18,18.68 21.85,18.68 22.21,19.03 R129.1
GPIO0: length 16
  Top Layer w0.127: Q17.3 36.89,25.81 37.58,26.5 37.58,29.05 37.41,29.21 34.05,29.21 33.75,29.51 33.75,30.44 31.85,32.34 R116.1 29.98,32.98 U1.23
GPIO13: length 11.7
  Top Layer w0.127: 27.88,32.96 28.92,31.91 29.33,31.91 30.91,30.33 32.56,30.33 33.85,29.04 33.85,28.69 33.41,28.25 33.41,27.11 33.99,26.54 R113.2
GPIO15: length 17.5
  Top Layer w0.127: 28.23,33.31 28.83,32.71 29.43,32.71 v1(30,32.14) ; R114.2 36.14,22.83 v1(36.9,23.59)
  Bottom Layer w0.127: v1(36.9,23.59) 36.9,26.79 35.1,28.59 33.88,28.59 33.5,28.21 32.1,28.21 30.9,29.41 30.9,31.24 v1(30,32.14)
GREEN: length 9.7
  Top Layer w0.203: 21.58,26.04 22.28,26.04 22.58,26.34 22.58,28.29 23.56,29.27 26.46,29.27 26.78,29.59 26.78,30.32 26.58,30.52 26.58,30.72 U1.15
HT_3V3: length 24.3
  Top Layer w0.254: 21.85,18.14 21.87,18.16 R129.2
  Top Layer w0.305: R129.2 v2(23.43,18.16)
  Top Layer w0.508: v1(28.53,13.71) 27.65,14.59 v2(27.65,15.74) 27.9,15.99 29.15,15.99 ; v1(31.48,5.06) 32.1,5.06 32.48,5.44 D21.2
  PWR w0.305: v2(23.43,18.16) 25.05,18.16 26.35,16.86 26.85,16.86 27.65,16.06 v2(27.65,15.74)
  Bottom Layer w0.508: v1(31.48,5.06) 30.48,5.06 28.53,7.01 v1(28.53,13.71)
I2C_SCL: length 163.7
  Top Layer w0.127: CN2.4 12.25,24.74 v1(12.9,25.39) ; v1(42.29,28.77) CN1.4 38.1,28.77 37.98,28.64 37.98,21.39 36.94,20.36 U71.5 ; 13.44,58.28 15.66,58.28 v1(16.63,57.31) 16.63,54.71 17.6,53.74 26.4,53.74 28.32,51.82 28.32,44.46 24,40.14 24,39.64 23.5,39.14 23.5,38.75 U1.39
  Bottom Layer w0.127: v1(16.63,57.31) 16.63,63.66 20.28,67.31 39.28,67.31 43.23,63.36 43.23,29.19 42.8,28.77 v1(42.29,28.77) ; 13.44,58.28 10.44,58.28 7.47,55.31 7.47,36.91 13.35,31.04 13.35,27.89 12.9,27.44 v1(12.9,25.39)
I2C_SDA: length 170.8
  Top Layer w0.127: CN1.3 42.42,26.77 v1(43.15,26.04) 43.15,22.24 41.43,20.51 38.1,20.51 37.44,19.86 U71.4 ; 13.44,60.82 11.58,60.82 v1(11.58,60.81) 10.98,60.21 10.98,52.79 11.95,51.81 23.68,51.81 25.96,49.53 R121.1 25.96,43.07 23.28,40.39 23.28,39.89 22.55,39.16 22.55,37.58 22.83,37.3
  Top Layer w0.305: v1(5.8,35.09) 5.8,28.39 7.45,26.74 CN2.3
  Bottom Layer w0.127: v1(11.58,60.81) 10.5,60.81 5.8,56.11 v1(5.8,35.09) ; 13.44,60.82 14.95,60.82 15.85,61.72 15.85,64.24 19.83,68.22 40.2,68.22 43.75,64.66 43.75,28.26 43.15,27.66 v1(43.15,26.04)
IN+: length 3.4
  Top Layer w0.127: R125.1 40.37,15.07 C33.2 39.74,15.04 39.54,14.85 39.54,14.32 39.32,14.1 U71.10
IN-: length 4.6
  Top Layer w0.127: U71.9 38.44,13.35 38.72,13.07 39.34,13.07 39.55,13.28 39.55,13.6 39.9,13.95 C33.1 40.37,13.93 R126.1
INA_ALERT: length 33.1
  Top Layer w0.127: v1(20.51,27.02) 21.41,27.02 21.95,27.56 21.95,28.31 23.18,29.54 24.48,29.54 25.4,30.46 U1.13 ; v1(34.85,16.84) 36.85,16.84 37.94,17.93 U71.3
  Bottom Layer w0.127: v1(34.85,16.84) 29.88,16.84 22.63,24.09 20.25,24.09 19.18,25.15 19.18,26.4 19.8,27.02 v1(20.51,27.02)
INT: length 62.3
  Top Layer w0.127: 13.44,50.66 13.35,50.56 11.35,50.56 9.75,52.16 9.75,60.58 11.35,62.18 13.89,62.18 15.17,60.89 15.17,60.14 17.8,57.51 17.8,57.09 17.23,56.51 17.23,54.86 17.75,54.34 27.18,54.34 v2(28.68,52.84) ; U1.24 30,33.66 30.73,33.66 v2(31.83,34.76)
  Bottom Layer w0.127: v2(28.68,52.84) 32.55,48.96 32.55,36.79 32.2,36.44 32.2,35.14 v2(31.83,34.76)
PWM: length 37.3
  Top Layer w0.127: U1.12 24.17,30.06 v2(23.93,30.06) ; v2(19.88,46.11) 17.87,48.12 13.44,48.12
  Bottom Layer w0.127: v2(19.88,46.11) 19.88,44.11 18.63,42.86 17.13,42.86 11.88,37.61 11.88,36.46 13.58,34.76 19.98,34.76 23.33,31.41 23.33,30.31 23.58,30.06 v2(23.93,30.06)
RED: length 11.4
  Top Layer w0.203: 21.58,24.84 21.59,24.84 22.3,24.84 23.08,25.61 23.08,28.26 23.78,28.97 26.75,28.97 27.13,29.34 27.13,30.88 U1.16
RTS: length 15.9
  Top Layer w0.127: Q16.2 29.01,23.79 29.56,23.24 v1(30.11,23.24) ; U2.19 33.49,23.62 33.99,24.11 R113.1 R106.1 36.05,24.51 v1(36.06,24.51)
  Bottom Layer w0.127: v1(30.11,23.24) 35.41,23.24 36.06,23.89 v1(36.06,24.51)
SD_CLK: length 28.9
  Top Layer w0.127: 27.17,37.3 27.74,37.86 28.78,37.86 31.1,40.19 46.83,40.19 48.1,38.91 48.1,35.28 47.17,34.34 45.92,34.34 U78.6
SD_DATA_0: length 31.9
  Top Layer w0.127: U78.5 47.64,33.08 48.53,33.96 48.53,39.36 47.25,40.64 31.2,40.64 28.7,38.14 27.3,38.14 U1.32
SD_DATA_1: length 41
  Top Layer w0.127: U1.33 26.87,38.41 28.63,38.41 31.33,41.11 47.28,41.11 48.93,39.46 48.93,33.76 47.6,32.44 44.57,32.44 44.32,32.69 44.32,33.44 42.14,35.62 40.37,35.62
SD_DATA_2: length 22.6
  Top Layer w0.127: 28.23,36.24 30.43,38.44 41.38,38.44 42.03,37.79 42.03,36.54 41.65,36.16 39.2,36.16 38.73,35.69 38.73,34.78 39.16,34.35 40.37,34.35
SD_DATA_3: length 26.1
  Top Layer w0.127: U78.7 45.92,35.62 47.16,35.62 47.7,36.16 47.7,38.71 46.68,39.74 31.02,39.74 U1.29
SPI_CLK: length 35.5
  Top Layer w0.127: U80.4 41.98,53.19 41.1,52.31 39,52.31 38.18,53.14 38.18,55.16 37.6,55.74 33.95,55.74 30.9,52.69 30.9,41.36 28.42,38.88 27.25,38.88 26.88,39.26 26.31,39.26 25.76,38.71
SPI_CS: length 34.2
  Top Layer w0.127: U80.5 43,56.44 43.33,56.11 43.33,53.41 41.6,51.69 39.03,51.69 37.52,53.2 U82.3 34.36,53.2 31.53,50.36 31.53,41.67 28.52,38.66 27.16,38.66 26.95,38.86 26.61,38.86 U1.34
SPI_SDI: length 41.9
  Top Layer w0.127: U80.2 38.05,56.44 37.53,56.96 36.55,56.96 36.3,57.21 U82.5 36.34,58.24 37.58,58.24 38.35,59.01 38.35,61.47 37.75,62.06 33.23,62.06 29.93,58.76 29.93,45.74 24.25,40.06 24.25,39.56 23.93,39.24 23.93,39.03 24.24,38.71
SPI_SDO: length 38.5
  Top Layer w0.127: U80.6 v1(41.98,58.41) ; U1.36 25.87,39.54 27,39.54 27.43,39.11 28.33,39.11 30.48,41.26 30.48,57.94 33.35,60.82 36.3,60.82
  Bottom Layer w0.127: 36.3,60.82 40.9,60.82 41.98,59.74 v1(41.98,58.41)
SRAM_CS: length 13.7
  Top Layer w0.127: 40.37,36.89 39.15,38.11 33.65,38.11 32.3,36.76 32.3,36.21 30.63,34.54 29.93,34.54 U1.25
U0RXD: length 61.5
  Top Layer w0.127: R111.1 31.99,29.65 v1(32,29.66) ; U1.40 23.1,38.44 23.1,39.06 23.78,39.74 23.78,40.24 27.3,43.76 27.3,51.66 v1(26.59,52.37) 25.77,53.2 13.44,53.2
  Bottom Layer w0.127: v1(32,29.66) 32,31.06 26.05,37.01 26.05,44.79 24.85,45.99 24.85,51.86 25.36,52.37 v1(26.59,52.37)
U0TXD: length 65.5
  Top Layer w0.127: 13.44,55.74 13.37,55.66 11.92,55.66 11.58,55.31 11.58,52.84 12.27,52.14 25.28,52.14 v1(25.91,51.5) 26.78,50.64 26.78,43.56 23.53,40.31 23.53,39.81 22.83,39.11 22.83,38.01 U1.41 ; v1(33.01,28.91) 33.01,25.4 R112.1
  Bottom Layer w0.127: v1(25.91,51.5) 25.91,48.15 27.68,46.39 27.68,43.49 26.5,42.31 26.5,42.19 26.48,42.18 26.48,41.48 27.1,40.86 27.1,36.44 33.01,30.53 v1(33.01,28.91)
UART_RX: length 1.4
  Top Layer w0.127: R112.2 32.99,23.08 U2.20
UART_TX: length 1.6
  Top Layer w0.127: R111.2 31.99,24.06 32.49,23.56 U2.21
USB+: length 19.6
  Top Layer w0.144: 30.25,21.32 21.31,21.32 21.2,21.42 21.2,21.76 21.1,21.86 21.01,21.86 20.9,21.76 20.9,21.42 20.8,21.32 20.71,21.32 20.6,21.42 20.6,21.76 20.5,21.86 20.41,21.86 20.3,21.76 20.3,21.42 20.2,21.32 18.26,21.32 16.17,19.24 16.17,16.29 U9.6
USB-: length 19.7
  Top Layer w0.144: U2.4 18.38,20.82 17.05,19.49 17.05,14.51 16.91,14.36 U9.4
USB_ESD+: length 7.1
  Top Layer w0.144: USB2.A6 12.31,15.72 12.85,16.26 U9.1
  Bottom Layer w0.144: USB2.B6 8.2,14.86 8.4,15.06 8.4,15.64 8.5,15.74 9.05,15.74 USB2.A6
USB_ESD-: length 7
  Top Layer w0.144: U9.3 10.4,14.36 9.89,14.87 USB2.A7 8.57,14.87 8.4,15.04 8.4,15.54 8.22,15.71 USB2.B7
USB_GATE_INV: length 4.6
  Top Layer w0.254: U94.4 19.35,17.37 19.2,17.52 18.35,17.52 18.12,17.75 18.12,18.15 ; 18.12,18.15 18.12,18.14 ; 18.12,18.15 18.12,18.49 18.3,18.67 19.02,18.67 19.36,19.01 19.9,19.01
$1N3149: length 15.6
  Top Layer w0.305: 31.58,14.09 32.65,14.09 v1(32.68,14.06) ; v1(32.9,12.19) 32.9,11.34 32.04,10.48 29.23,10.48 U86.4 ; U92.1 37.63,10.19 36.68,11.14 v1(35.88,11.14)
  PWR w0.305: v1(32.68,14.06) 32.9,13.84 v1(32.9,12.19) 33.85,12.19 34.9,11.14 v1(35.88,11.14)
$1N3363: length 3.5
  Top Layer w0.305: U90.4 41.53,11.19 41.2,11.51 40,11.51 39.63,11.14 U92.2
$1N3445: length 8.7
  Top Layer w0.305: 36.23,12.09 35.4,12.09 35,12.49 35,13.21 33.18,15.03 33.04,15.03 33.03,15.04 29.15,15.04
$1N8591: length 3.7
  Top Layer w0.305: U128.3 23.13,56.76 22.94,56.58 R135.2 R134.1
$1N14453: length 2.3
  Top Layer w0.508: C174.2 26.11,7 25.72,6.61 U72.1
$1N14659: length 11.9
  Top Layer w0.305: U72.3 23.35,8.06 24.88,9.6 29.55,9.6 29.81,9.33 29.81,8.72 30.27,8.27 R137.2 R136.1
$2N4651: length 23.2
  Top Layer w0.142: U1.2 20.38,33.34 10.55,33.34 2.21,41.68 R101.2
$2N4659: length 7.8
  Top Layer w0.203: U1.3 20.66,32.91 16.5,32.91 15.69,32.1
  Top Layer w0.254: 15,31.46 15.64,32.1 15.69,32.1 ; U1.3 U1.4
$2N4669: length 2.5
  Top Layer w0.203: U1.18 27.74,31.68 27.74,30.02 R2.1
$2N5562: length 3.9
  Top Layer w0.254: 19.51,37.41 19.08,36.98 19.08,36.64 18.84,36.4 19.35,35.89 20.7,35.89 U1.47
$2N5759: length 3
  Top Layer w0.254: U1.45 21.45,36.55 21.45,36.91 21.45,36.91 21.45,37.86 20.61,38.71
$2N5845: length 6.2
  Top Layer w0.254: U6.1 18.89,38 C12.1 17.98,37.17 C11.1 17.34,36.5 18.35,35.49 20.4,35.49 U1.48
$2N5921: length 5.1
  Top Layer w0.254: C13.1 19.29,42.04 19.32,42.04 18.58,41.29 18.58,40.74 U4.2
$2N5944: length 6.8
  Top Layer w0.203: U1.44 21.81,36.9 21.81,39.23 22.42,39.84 22.42,40.17 C21.1
  Top Layer w0.254: X2.4 22.83,41.64 22.83,40.99 C21.1
$2N10074: length 1.4
  Top Layer w0.142: C25.2 3.53,43.8 R101.1
$2N10076: length 2.9
  Top Layer w0.142: C26.2 U81.2 3.56,44.91
$2N10117: length 3.8
  Top Layer w0.142: U77.3 3.57,50.26 L4.2 3.56,50.24 C26.1
$3N4762: length 14.4
  Top Layer w0.254: BUZZER1.2 17.1,25.19 18.77,23.52 22.62,23.52 22.88,23.77 D4.2 22.88,24.22 23.68,24.22 24.5,25.04 25.75,25.04 26.03,25.31 26.03,28.06 Q15.3
$3N5003: length 1.3
  Top Layer w0.254: R104.2 25.09,26.08 Q15.1
$3N5332: length 4.1
  Top Layer w0.127: Q17.1 37.01,27.01 36.79,26.79 35.39,26.79 35.01,26.41 R106.2
$3N5334: length 2.5
  Top Layer w0.127: R105.2 30.91,25.41 Q16.1
$3N6540: length 3.6
  Top Layer w0.127: 31.49,19.07 31.49,18.44 31.13,18.08 v1(31.13,17.5) ; v1(31.13,17.5) 32.14,17.5 R108.2 ; v1(31.13,17.5) R107.1
$3N6650: length 2.7
  Top Layer w0.127: R109.1 33.34,18.04 33.11,18.26 32.19,18.26 31.99,18.46 31.99,19.07
$3N6731: length 1.7
  Top Layer w0.127: U2.15 35.18,20.82 35.29,20.71 35.29,20.17 35.31,20.15
$3N7291: length 9.4
  Top Layer w0.254: v1(10.71,39.45) SW1.2 ; v1(10.71,39.45) 10.7,39.45 C30.1 10.71,37.94 10.71,36.72 R115.2 ; v1(10.71,39.45) SW1.1
$3N7647: length 9.3
  Top Layer w0.254: SW4.1 v1(34.5,33.85) SW4.2 ; R116.2 31.86,33.83 32.97,33.83 C31.1 34.49,33.85
$3N10620: length 4.1
  Top Layer w0.203: LED1.1 20.44,28.15 19.58,27.29 19.58,26.46 20,26.04 R119.1
$3N10658: length 8.4
  Top Layer w0.203: LED1.2 21.11,29.54 20.38,29.54 19.77,28.93 19.77,27.93 19.32,27.47 18.96,27.47 18.38,26.89 18.38,25.61 19.15,24.84 R120.1
$3N15296: length 5.6
  Top Layer w0.203: R123.2 15.27,20.04 15.48,20.24 15.48,20.73 R124.1 15.47,21.7 15.25,21.91 C182.2 14.36,21.92 R138.2
$5N1088: length 7.4
  Top Layer w0.254: R102.1 5.5,9.69 6.27,10.46 6.27,13.31 6.98,14.01 USB2.B5
$5N1129: length 1.3
  Top Layer w0.254: R103.1 10.39,16.57 USB2.A5
$5N1175: length 13.2
  Top Layer w0.508: USB2.B4 9.07,13.16 USB2.A9 9.77,13.17 10.2,12.74 11.28,12.74 L1.2 ; USB2.B9 9.07,17.41 USB2.A4
  Bottom Layer w0.508: USB2.B9 6.53,17.41 5.3,16.19 5.3,13.91 6.05,13.16 USB2.B4
$5N1423: length 13.3
  Top Layer w0.305: U9.5 15.48,15.31 15.02,14.86 15.02,14.16 14.35,13.49 13.1,13.49 12.65,13.04 12.65,11.54 12.01,10.9 L1.1
  Top Layer w0.508: D5.2 8.8,9.35 C27.2 11.1,9.36 11.38,9.64 L1.1

## Copper pours and planes (outline as drawn; the poured copper is in the pictures)
+3V3 on Top Layer: 25.65,63.29 28.94,63.29 28.94,56.41 25.65,56.41
+3V3 on PWR: -1.63,73.57 51.03,73.57 51.03,13.24 -1.63,13.24
+5V on Top Layer: 18.73,59.58 21.89,59.58 21.89,54.88 18.73,54.88
GND on Top Layer: -2.68,72.14 53.13,72.14 53.13,-3.09 -2.68,-3.09
GND on Top Layer: 36.14,4.23 40.84,4.23 40.84,0.66 36.14,0.66
GND on Top Layer: 13.14,12.97 17.84,12.97 17.84,9.32 13.14,9.32
GND on Bottom Layer: -3.5,73.39 53.13,73.39 53.13,-4.31 -3.5,-4.31
GND on GND: 0.26,69.74 49.74,69.74 49.74,0.26 0.26,0.26
VBUS on Top Layer: 10.22,8.66 18.19,8.66 18.19,5.93 10.22,5.93
VCC_BT on Top Layer: 36.01,6.94 45.01,6.94 45.01,5.42 36.01,5.42
VCC_HT on Top Layer: 12.14,5.65 24.71,5.65 24.71,0.33 12.14,0.33
ALWAYS_ON_IN on Top Layer: 20.62,12.65 23.38,12.65 23.38,9.82 20.62,9.82
ALWAYS_ON_OUT on Top Layer: 17.2,18.66 31.15,18.66 31.15,11.82 17.2,11.82
ALWAYS_ON_OUT on Top Layer: 23.04,14.55 25.55,14.55 25.55,13.03 23.04,13.03
ALWAYS_ON_OUT on Bottom Layer: 17.17,18.67 31.12,18.67 31.12,11.84 17.17,11.84
ALWAYS_ON_OUT on PWR: -0.58,13.24 50.53,13.24 50.53,-0.19 -0.58,-0.19
HT_3V3 on Top Layer: 29.04,6.43 32.04,6.43 32.04,3.38 29.04,3.38
$1N8585 on Top Layer: 19.1,63.11 25.18,63.11 25.18,58.19 19.1,58.19
$1N14493 on Top Layer: 24.89,9.08 29.36,9.08 29.36,3.27 24.89,3.27

Small or netless copper shapes (teardrops, artwork), in the pictures only: 36 on GND
